# Altium schematic sheet DeskDigitalClock.SchDoc
size A4
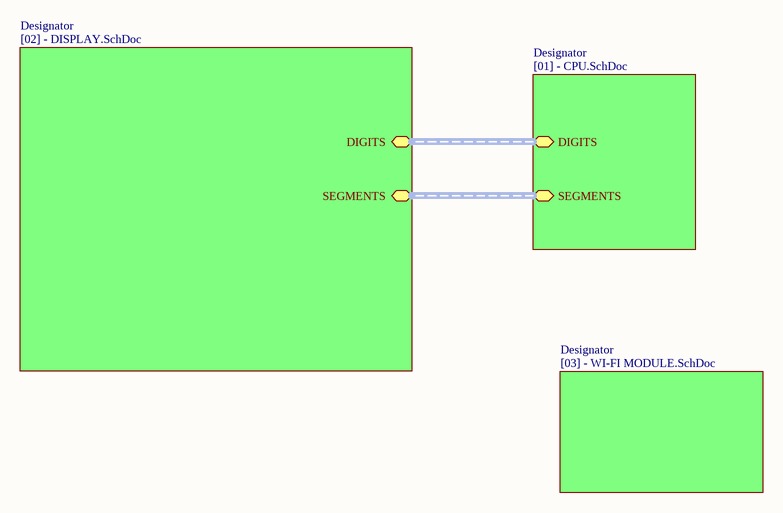
[diagram p0: DeskDigitalClock.SchDoc]

## Sub-sheets
Designator = [01] - CPU.SchDoc: DIGITS (harness DIGITS), SEGMENTS (harness SEGMENTS)
Designator = [02] - DISPLAY.SchDoc: DIGITS (harness DIGITS), SEGMENTS (harness SEGMENTS)
Designator = [03] - WI-FI MODULE.SchDoc: no entries